# EAGLE board GD32F470 (EAGLE 9.6.2)
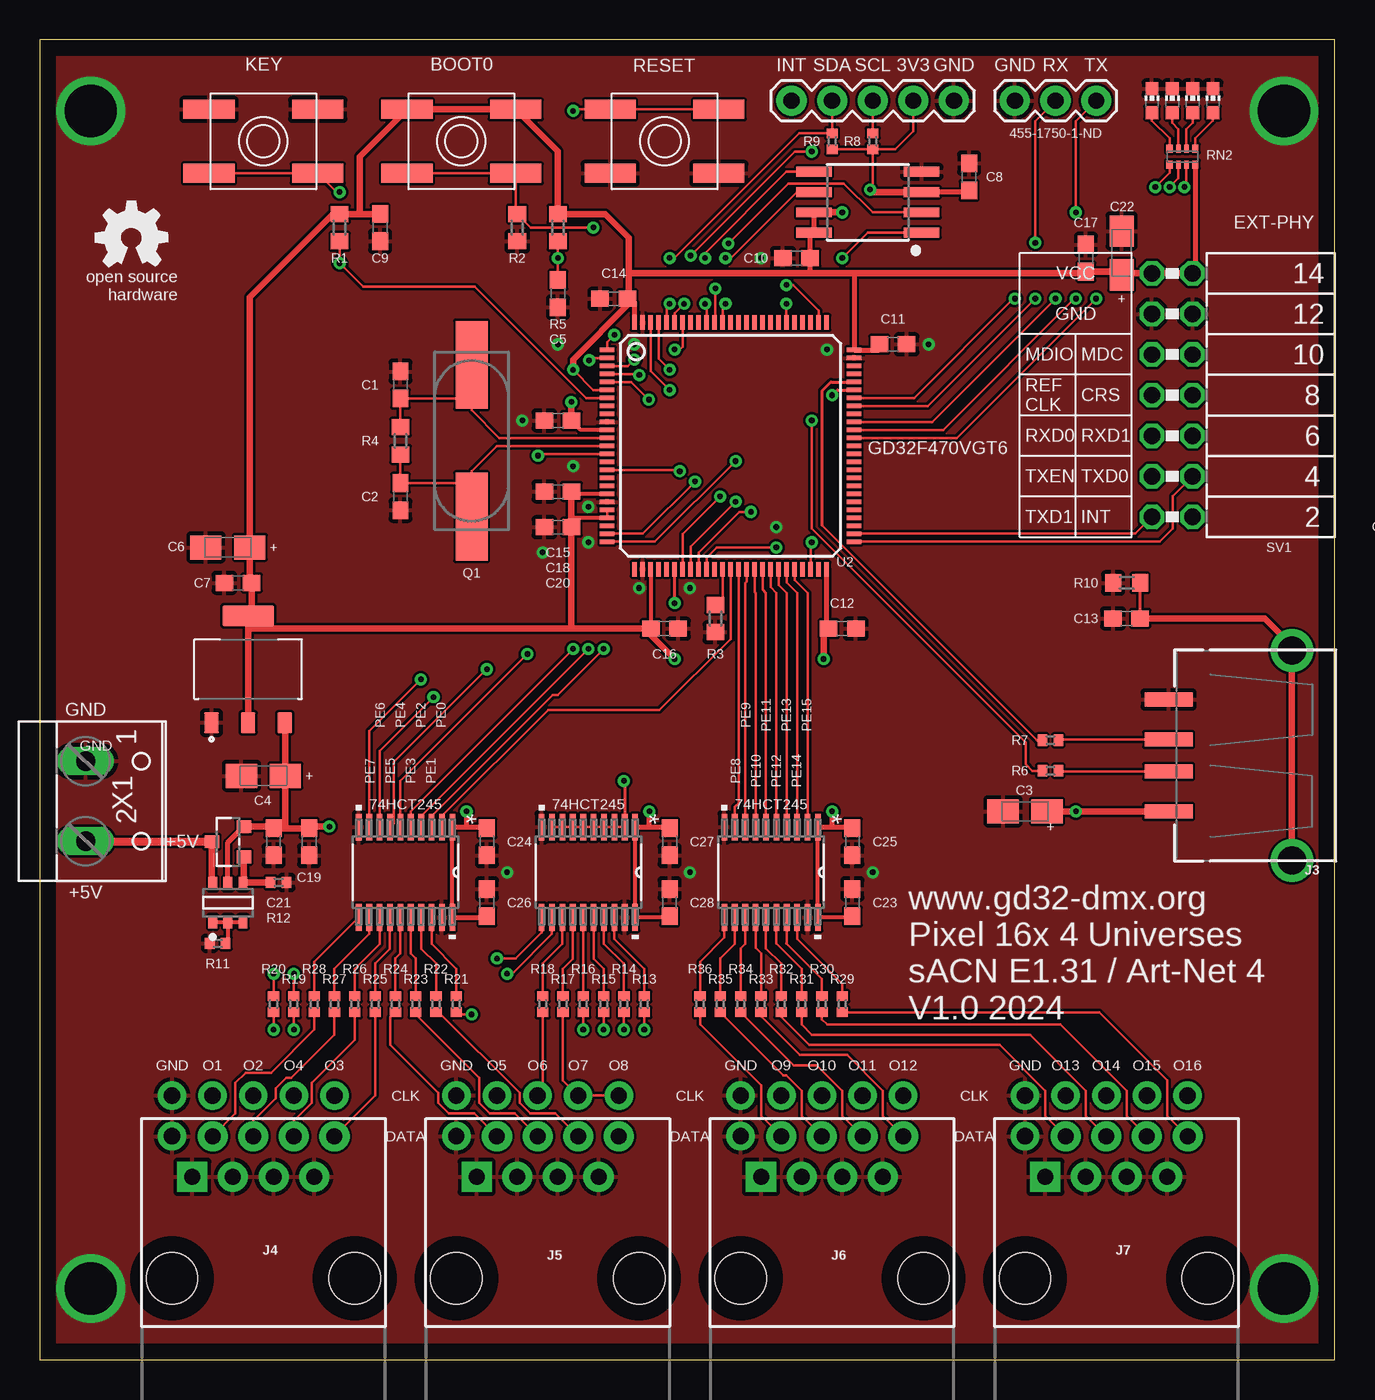
[diagram p1: board, top side]
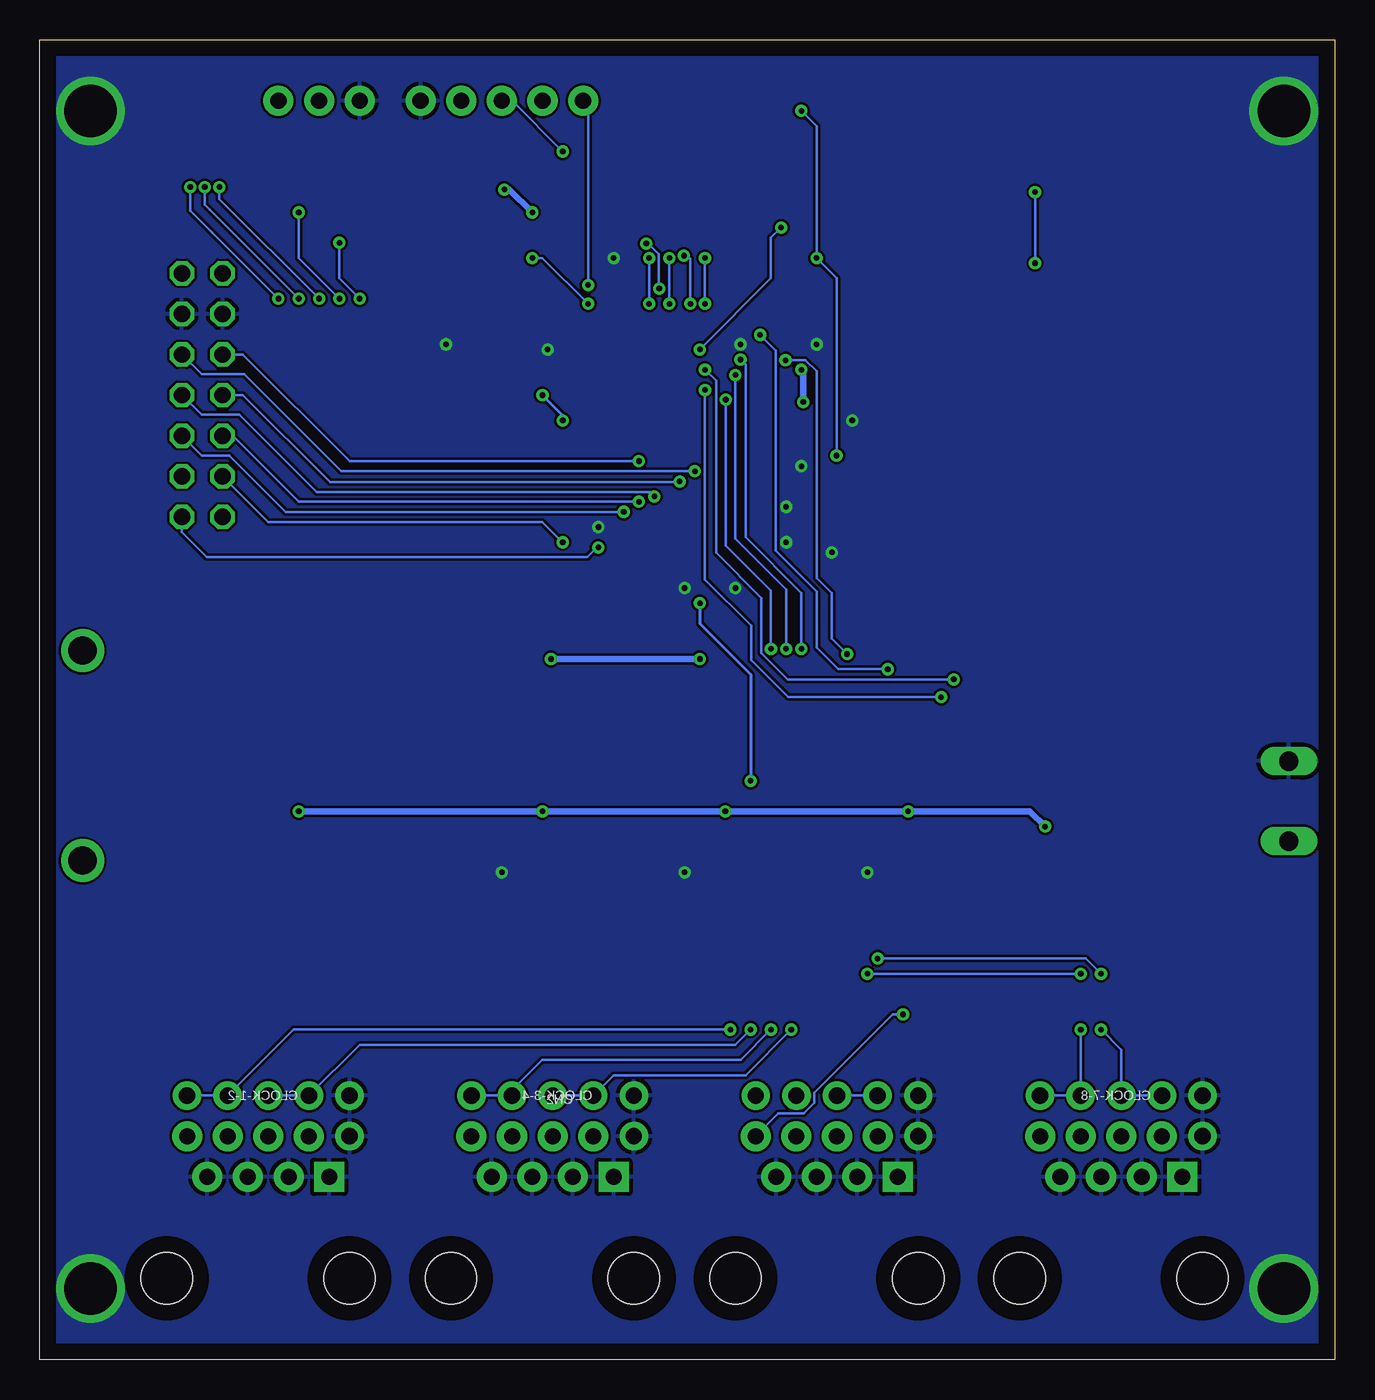
[diagram p2: board, bottom side, seen from below]

Size 80.95 x 82.54 mm. Coordinates in mm from the lower left corner, seen from the top.
Outline: 0,0 80.95,0 80.95,82.54 0,82.54 0,0
Copper layers (1*16): Top 0.035mm / dielectric 1.5mm / Bottom 0.035mm
Design rules "default": minimum track width 6mil, minimum drill 0.35mm, track to track 6mil, track to pad 6mil, pad to pad 6mil, via to via 6mil, smd to smd 6mil, copper to edge 40mil, drill to drill 6mil, minimum pad ring 10mil, minimum via ring 8mil, stop-mask expansion 4mil, vias tented up to drill 0mil, thermal gap 10mil

## Footprints (pad centres in the part's own frame; a part is rotated, then mirrored left to right if it is on the bottom)
C0603 = smd 1.1 x 1: 1 -0.85,0; 2 0.85,0
A/3216-18R = smd 1.95 x 1.5: + 1.375,0; - -1.375,0
1X04-CLEANBIG = drill 1.016 pad 1.778: 1 -3.81,0; 2 -1.27,0; 3 1.27,0; 4 3.81,0
1X03 = drill 1.016 pad 1.88: 1 0,0; 2 2.54,0; 3 5.08,0
1X05 = drill 1.016 pad 1.88: 1 0,0; 2 2.54,0; 3 5.08,0; 4 7.62,0; 5 10.16,0
USB-A = smd 3 x 0.9: D+ 7.212,-1; D- 7.212,1; GND 7.212,-3.5; VBUS 7.212,3.5 | drill 1.778: SHLD1 -0.492,-6.566; SHLD2 -0.492,6.566
RJ45-8 = drill 1 pad 1.88 square: 1 -4.445,6.35 | drill 1 pad 1.88: 2 -3.175,8.89; 3 -1.905,6.35; 4 -0.635,8.89; 5 0.635,6.35; 6 1.905,8.89; 7 3.175,6.35; 8 4.445,8.89 | hole 3.2: -5.715,0; 5.715,0
1X01-CLEANBIG = drill 1.016 pad 1.778: 1 0,0
CHIP-LED0603 = smd 0.8 x 0.8: A 0,-0.75; C 0,0.75
CSM-7X-DU = smd 5.5 x 2: 1 -4.75,0; 2 4.75,0
DIODES_INC._DMG2305UX-13_0 = smd 0.9 x 0.8: 1 -1,0.95; 2 -1,-0.95; 3 1,0
DIODES_DMMT5401-7-F_0 = smd 0.8 x 0.55: 1 -1.2,0.95; 2 -1.2,0; 3 -1.2,-0.95; 4 1.2,-0.95; 5 1.2,0; 6 1.2,0.95
R0603 = smd 1 x 1.1: 1 -0.85,0; 2 0.85,0
R0402 = smd 0.6 x 0.7: 1 -0.5,0; 2 0.5,0
4X0402ARV341 = smd 0.4 x 0.5: 1 -0.8,-0.5; 4 0.8,-0.5; 5 0.8,0.5; 8 -0.8,0.5 | smd 0.3 x 0.5: 2 -0.25,-0.5; 3 0.25,-0.5; 6 0.25,0.5; 7 -0.25,0.5
FE07-2W = drill 1.016 octagon: 1 -7.62,1.27; 2 -7.62,-1.27; 3 -5.08,1.27; 4 -5.08,-1.27; 5 -2.54,1.27; 6 -2.54,-1.27; 7 0,1.27; 8 0,-1.27; 9 2.54,1.27; 10 2.54,-1.27; 11 5.08,1.27; 12 5.08,-1.27; 13 7.62,1.27; 14 7.62,-1.27
EVQ-Q2 = smd 3.2 x 1.2: A -3.4,-2; A' 3.4,-2; B -3.4,2; B' 3.4,2
SOT229P700X180-4N = smd 0.93 x 1.31: 1 -2.29,-3.345; 2 0,-3.345; 3 2.29,-3.345 | smd 3.24 x 1.31: 4 0,3.345
LQFP100 = smd 0.9 x 0.3: 1 -7.72,6; 2 -7.72,5.5; 3 -7.72,5; 4 -7.72,4.5; 5 -7.72,4; 6 -7.72,3.5; 7 -7.72,3; 8 -7.72,2.5; 9 -7.72,2; 10 -7.72,1.5; 11 -7.72,1; 12 -7.72,0.5; 13 -7.72,0; 14 -7.72,-0.5; 15 -7.72,-1; 16 -7.72,-1.5; 17 -7.72,-2; 18 -7.72,-2.5; 19 -7.72,-3; 20 -7.72,-3.5; 21 -7.72,-4; 22 -7.72,-4.5; 23 -7.72,-5; 24 -7.72,-5.5; 25 -7.72,-6; 51 7.72,-6; 52 7.72,-5.5; 53 7.72,-5; 54 7.72,-4.5; 55 7.72,-4; 56 7.72,-3.5; 57 7.72,-3; 58 7.72,-2.5; 59 7.72,-2; 60 7.72,-1.5; 61 7.72,-1; 62 7.72,-0.5; 63 7.72,0; 64 7.72,0.5; 65 7.72,1; 66 7.72,1.5; 67 7.72,2; 68 7.72,2.5; 69 7.72,3; 70 7.72,3.5; 71 7.72,4; 72 7.72,4.5; 73 7.72,5; 74 7.72,5.5; 75 7.72,6 | smd 0.3 x 0.9: 26 -6,-7.72; 27 -5.5,-7.72; 28 -5,-7.72; 29 -4.5,-7.72; 30 -4,-7.72; 31 -3.5,-7.72; 32 -3,-7.72; 33 -2.5,-7.72; 34 -2,-7.72; 35 -1.5,-7.72; 36 -1,-7.72; 37 -0.5,-7.72; 38 0,-7.72; 39 0.5,-7.72; 40 1,-7.72; 41 1.5,-7.72; 42 2,-7.72; 43 2.5,-7.72; 44 3,-7.72; 45 3.5,-7.72; 46 4,-7.72; 47 4.5,-7.72; 48 5,-7.72; 49 5.5,-7.72; 50 6,-7.72; 76 6,7.72; 77 5.5,7.72; 78 5,7.72; 79 4.5,7.72; 80 4,7.72; 81 3.5,7.72; 82 3,7.72; 83 2.5,7.72; 84 2,7.72; 85 1.5,7.72; 86 1,7.72; 87 0.5,7.72; 88 0,7.72; 89 -0.5,7.72; 90 -1,7.72; 91 -1.5,7.72; 92 -2,7.72; 93 -2.5,7.72; 94 -3,7.72; 95 -3.5,7.72; 96 -4,7.72; 97 -4.5,7.72; 98 -5,7.72; 99 -5.5,7.72; 100 -6,7.72
SO08-EIAJ = smd 0.61 x 2.21: 1 -1.905,-3.378; 2 -0.635,-3.378; 3 0.635,-3.378; 4 1.905,-3.378; 5 1.905,3.353; 6 0.635,3.353; 7 -0.635,3.353; 8 -1.905,3.353
PW20 = smd 1.676 x 0.356: 1 -2.819,2.925; 2 -2.819,2.275; 3 -2.819,1.625; 4 -2.819,0.975; 5 -2.819,0.325; 6 -2.819,-0.325; 7 -2.819,-0.975; 8 -2.819,-1.625; 9 -2.819,-2.275; 10 -2.819,-2.925; 11 2.819,-2.925; 12 2.819,-2.275; 13 2.819,-1.625; 14 2.819,-0.975; 15 2.819,-0.325; 16 2.819,0.325; 17 2.819,0.975; 18 2.819,1.625; 19 2.819,2.275; 20 2.819,2.925
W237-102 = drill 1.194 long: 1 -2.5,-1.27; 2 2.5,-1.27

## Placement (x,y rotation side)
C1  20pF  [C0603]  22.54,60.96 270 top
C2  20pF  [C0603]  22.54,53.98 90 top
C3  10uF  [A/3216-18R]  61.59,34.29 0 top
C4  10uF  [A/3216-18R]  13.97,36.51 0 top
C5  100n  [C0603]  32.38,66.67 270 top
C6  10uF  [A/3216-18R]  11.75,50.8 0 top
C7  100n  [C0603]  12.38,48.58 180 top
C8  100n  [C0603]  58.1,73.98 90 top
C9  100n  [C0603]  21.27,70.8 270 top
C10  100n  [C0603]  47.31,68.9 180 top
C11  100n  [C0603]  53.34,63.5 0 top
C12  100n  [C0603]  50.16,45.72 0 top
C13  4700pF/50V  [C0603]  67.94,46.36 180 top
C14  100n  [C0603]  35.88,66.36 180 top
C15  100n  [C0603]  32.38,58.74 180 top
C16  100n  [C0603]  39.05,45.72 0 top
C17  100n  [C0603]  65.41,68.9 90 top
C18  100n  [C0603]  32.38,54.29 180 top
C19  100n  [C0603]  16.83,32.38 270 top
C20  100n  [C0603]  32.38,52.07 180 top
C21  100n  [C0603]  14.61,32.38 270 top
C22  10uF  [A/3216-18R]  67.63,69.21 270 top
C23  100n  [C0603]  50.8,28.57 90 top
C24  100n  [C0603]  27.94,32.38 270 top
C25  100n  [C0603]  50.8,32.38 270 top
C26  100n  [C0603]  27.94,28.57 90 top
C27  100n  [C0603]  39.37,32.38 270 top
C28  100n  [C0603]  39.37,28.57 90 top
CN1  CLOCK-1-2  [1X04-CLEANBIG]  67.94,16.51 180 top
CN2  CLOCK-3-4  [1X04-CLEANBIG]  50.16,16.51 180 top
CN3  CLOCK-5-6  [1X04-CLEANBIG]  32.38,16.51 180 top
CN4  CLOCK-7-8  [1X04-CLEANBIG]  14.61,16.51 180 top
GOLD_ORB_SM1  OSHWLOGOLOGO5MM  [OSHW_5MM]  5.71,70.17 0 top
J1  455-1750-1-ND  [1X03]  60.96,78.74 0 top
J2  I2C+INT  [1X05]  57.15,78.74 180 top
J3  USB_A_SMT_FEMALE  [USB-A]  77.79,37.78 180 top
J4  RJ45  [RJ45-8]  13.97,5.08 0 top
J5  RJ45  [RJ45-8]  31.75,5.08 0 top
J6  RJ45  [RJ45-8]  49.53,5.08 0 top
J7  RJ45  [RJ45-8]  67.31,5.08 0 top
JP1  GND  [1X01-CLEANBIG]  61.59,16.51 0 top
JP2  GND  [1X01-CLEANBIG]  43.81,16.51 0 top
JP3  GND  [1X01-CLEANBIG]  26.04,16.51 0 top
JP4  GND  [1X01-CLEANBIG]  8.26,16.51 0 top
JP5  GND  [1X01-CLEANBIG]  43.81,13.97 0 top
JP6  GND  [1X01-CLEANBIG]  61.59,13.97 0 top
JP7  GND  [1X01-CLEANBIG]  26.04,13.97 0 top
JP8  GND  [1X01-CLEANBIG]  8.26,13.97 0 top
LED5  PWR  [CHIP-LED0603]  73.34,78.74 0 top
LED6  PC7  [CHIP-LED0603]  72.07,78.74 0 top
LED7  PC8  [CHIP-LED0603]  70.8,78.74 0 top
LED8  PC9  [CHIP-LED0603]  69.53,78.74 0 top
Q1  25 MHz  [CSM-7X-DU]  26.99,57.47 90 top
Q2  DMG2305UX  [DIODES_INC._DMG2305UX-13_0]  11.75,32.38 180 top
Q3  DMMT5401  [DIODES_DMMT5401-7-F_0]  11.75,28.57 90 top
R1  10K  [R0603]  18.73,70.8 90 top
R2  10K  [R0603]  29.84,70.8 90 top
R3  10K  [R0603]  42.23,46.36 270 top
R4  1M  [R0603]  22.54,57.47 270 top
R5  10K  [R0603]  32.38,70.8 90 top
R6  22  [R0402]  63.18,36.83 180 top
R7  22  [R0402]  63.18,38.74 180 top
R8  4K7  [R0402]  52.07,76.2 270 top
R9  4K7  [R0402]  49.53,76.2 270 top
R10  1M  [R0603]  67.94,48.58 0 top
R11  10K  [R0402]  11.11,26.04 0 top
R12  47K  [R0402]  14.92,29.84 180 top
R13  100  [R0402]  37.78,22.22 270 top
R14  100  [R0402]  36.51,22.22 270 top
R15  100  [R0402]  35.24,22.22 270 top
R16  100  [R0402]  33.97,22.22 270 top
R17  100  [R0402]  32.7,22.22 270 top
R18  100  [R0402]  31.43,22.22 270 top
R19  100  [R0402]  15.88,22.22 270 top
R20  100  [R0402]  14.61,22.22 270 top
R21  100  [R0402]  26.04,22.22 270 top
R22  100  [R0402]  24.77,22.22 270 top
R23  100  [R0402]  23.5,22.22 270 top
R24  100  [R0402]  22.23,22.22 270 top
R25  100  [R0402]  20.95,22.22 270 top
R26  100  [R0402]  19.68,22.22 270 top
R27  100  [R0402]  18.41,22.22 270 top
R28  100  [R0402]  17.14,22.22 270 top
R29  100  [R0402]  50.16,22.22 270 top
R30  100  [R0402]  48.9,22.22 270 top
R31  100  [R0402]  47.62,22.22 270 top
R32  100  [R0402]  46.35,22.22 270 top
R33  100  [R0402]  45.09,22.22 270 top
R34  100  [R0402]  43.81,22.22 270 top
R35  100  [R0402]  42.55,22.22 270 top
R36  100  [R0402]  41.27,22.22 270 top
RN2  2K  [4X0402ARV341]  71.44,75.25 180 top
SV1  EXT-PHY  [FE07-2W]  70.8,60.33 90 top
SW1  KEY  [EVQ-Q2]  13.97,76.2 180 top
SW2  BOOT0  [EVQ-Q2]  26.35,76.2 180 top
SW3  RESET  [EVQ-Q2]  39.05,76.2 0 top
U1  AMS1117-3.3  [SOT229P700X180-4N]  13.02,43.18 0 top
U2  GD32F470VGT6  [LQFP100]  43.18,57.15 0 top
U3  25F32006WSOI  [SO08-EIAJ]  51.75,72.39 90 top
U4  74HCT245  [PW20]  22.86,30.48 270 top
U5  74HCT245  [PW20]  45.72,30.48 270 top
U6  74HCT245  [PW20]  34.29,30.48 270 top
X1  +5V  [W237-102]  4.13,34.93 270 top

## Tracks (layer width: path | path; a pad name or v marks a point on that pad's centre or on a via)
+3V3  (via drill 0.35)
  Top 0.152: C12.1 49.18,45.86 | U2.21 U2.22 | C11.1 52.49,63.15 | U2.6 34.6,60.65 v33.34,61.91 | J2.2 54.61,76.83 53.48,75.7 R8.2 | R8.2 R9.2 | R8.2 52.07,73.34 v51.91,73.18
  Top 0.254: U2.22 33.29,52.65 33.23,52.71 | U2.19 33.38,54.15 C18.1 | U2.28 38.18,45.74 C16.1 | U2.11 33.82,58.15 C15.1
  Top 0.305: 49.18,45.86 U2.50 | 52.49,63.15 U2.75 50.9,67.84 50.8,67.94 | C8.1 58.08,73.02 U3.3 | U3.7 U3.8 48.16,70.24 C10.1 48.16,68.05 48.26,67.94 | C14.1 36.83,66.46 37.18,66.11 U2.100 | R1.2 18.31,71.65 | 65.3,67.94 C17.1 | RN2.8 72.24,68.43 71.75,67.94
  Top 0.406: C12.1 49,45.4 v49,43.82 | C18.1 33.23,52.71 C20.1 33.23,45.72 C16.1 | C16.1 38.2,45.93 38.1,45.82 38.1,45.4 v39.69,43.82 | v33.23,59.9 33.23,59.89 C15.1 | 13.02,45.72 U1.4 13.23,46.74 C7.1 13.12,48.69 C6.+ 13.12,66.46 18.31,71.65 | 13.02,45.72 U1.2 | C9.1 20,71.65 | 20,71.65 R1.2 | 20,71.65 20,75.25 SW2.A' SW2.A 32.38,75.57 R5.2 35.34,71.65 36.83,70.17 36.83,67.94 | C16.1 13.02,45.72 | U3.7 v50.16,71.75 | U3.3 52.07,73.02 v51.91,73.18 | 36.83,67.94 36.83,66.46 36.83,66.04 33.34,62.55 v33.34,61.91 | 36.83,67.94 48.26,67.94 50.8,67.94 65.3,67.94 | C17.1 67.42,68.05 C22.+ 67.73,67.94 SV1.13 71.75,67.94 SV1.14
  Bottom 0.406: v49,43.82 v39.69,43.82 | v33.23,59.9 33.23,61.8 v33.34,61.91 | v50.16,71.75 51.59,73.18 v51.91,73.18
+5V  (via drill 0.35)
  Top 0.254: U5.1 | U5.1 U5.20 50.74,27.66 C23.1 | C28.1 39.31,27.66 U6.20 U6.1 | U4.1 | U4.20 U4.1 | U6.1
  Top 0.305: Q3.5 11.75,32.34 Q2.2 | U4.20 27.88,27.66 C26.1 | U4.1 26.67,33.3 | 26.67,33.3 27.88,33.3 C24.1 | U6.1 38.1,33.3 | 38.1,33.3 39.31,33.3 C27.1 | U5.1 49.53,33.3 | 49.53,33.3 50.74,33.3 C25.1 | 26.67,33.3 v26.67,34.29 | 38.1,33.3 v38.1,34.29 | 49.53,33.3 v49.53,34.29
  Top 0.406: U1.3 15.35,39.8 C4.+ 15.35,33.34 15.24,33.23 | 15.24,33.23 C19.1 16.93,33.34 v18.1,33.34 | 15.24,33.23 C21.1 14.51,33.34 Q2.2 | C3.+ v64.77,34.29 70.57,34.29 J3.VBUS
  Bottom 0.406: v18.1,33.34 19.05,34.29 v26.67,34.29 v38.1,34.29 v49.53,34.29 v64.77,34.29
BOOT0  (via drill 0.35)
  Top 0.152: SW2.B' SW2.B 29.75,71.74 R2.2 30.7,70.8 v34.61,70.8 | U2.94 40.18,63.36 40.01,63.18 v39.69,63.18
  Bottom 0.152: v39.69,63.18 35.24,67.63 35.24,70.17 v34.61,70.8
BOOT1
  Top 0.152: U2.37 42.68,47.66 R3.1
BOOT_RX  (via drill 0.35)
  Top 0.152: U2.69 54.66,60.15 60.87,66.36 v60.96,66.36 | J1.2 62.23,77.47 v62.23,69.85
  Bottom 0.152: v62.23,69.85 62.23,67.63 v60.96,66.36
BOOT_TX  (via drill 0.35)
  Top 0.152: v62.23,66.36 55.52,59.65 U2.68 | v64.77,71.75 64.77,77.47 J1.3
  Bottom 0.152: v64.77,71.75 64.77,68.9 v62.23,66.36
CLK1  (via drill 0.35)
  Top 0.152: R13.2 v37.78,20.64
  Bottom 0.152: CN1.1 CN1.2 65.09,20.64 v37.78,20.64
CLK2  (via drill 0.35)
  Top 0.152: R14.2 v36.51,20.64
  Bottom 0.152: CN1.3 CN1.4 60.96,19.68 37.47,19.68 v36.51,20.64
CLK3  (via drill 0.35)
  Top 0.152: R15.2 v35.24,20.64
  Bottom 0.152: CN2.1 51.75,16.51 | 51.75,16.51 CN2.2 | 51.75,16.51 49.53,18.73 37.15,18.73 v35.24,20.64
CLK4  (via drill 0.35)
  Top 0.152: R16.2 v33.97,20.64
  Bottom 0.152: CN2.3 CN2.4 45.09,17.78 36.83,17.78 v33.97,20.64
CLK5
  Top 0.152: R17.2 32.7,17.46 CN3.2 CN3.1
CLK6
  Top 0.152: CN3.3 31.43,16.83 R18.2
  Bottom 0.152: CN3.4 CN3.3
CLK7  (via drill 0.35)
  Top 0.152: v15.88,20.64 R19.2
  Bottom 0.152: CN4.1 CN4.2 v15.88,20.64
CLK8  (via drill 0.35)
  Top 0.152: v14.61,20.64 R20.2
  Bottom 0.152: CN4.4 CN4.3 13.34,19.37 v14.61,20.64
ENET_MDC  (via drill 0.35)
  Top 0.152: U2.16 39.92,55.65 v40.01,55.56
  Bottom 0.152: SV1.10 70.84,61.63 68.17,61.63 62.1,55.56 v40.01,55.56
ENET_MDIO  (via drill 0.35)
  Top 0.152: v43.5,56.2 38.45,51.15 U2.25
  Bottom 0.152: SV1.9 68.26,62.87 61.59,56.2 v43.5,56.2
GND  (via drill 0.35, 3.28)
  other vias: 52.07,30.48 29.21,30.48 3.17,78.1 77.79,78.1 55.56,63.5 40.64,30.48 37.15,63.5 49.21,63.18 30.16,58.74 31.43,50.48 40.64,48.26 37.47,48.26 77.79,4.45 3.17,4.45 34.29,51.12 33.34,55.88 34.29,53.34 32.38,63.5 46.04,52.07 45.09,68.9
  pour Top: -1.27,0 82.23,0 82.23,82.55 -1.27,82.55
  pour Bottom: -1.27,82.55 -1.27,0 82.23,0 82.23,82.55
I2C0_SCL  (via drill 0.35)
  Top 0.152: v40.28,66.04 39.68,65.44 U2.95 | J2.3 R8.1 | v40.68,69.05 47.2,75.56 v48.26,75.56
  Bottom 0.152: v40.28,66.04 40.28,68.85 40.48,69.05 v40.68,69.05 | v48.26,75.56 51.44,78.74 J2.3
I2C0_SDA  (via drill 0.35)
  Top 0.152: v39.37,66.04 39.18,65.85 U2.96 | v39.37,68.9 39.4,68.93 39.7,68.93 47.48,76.7 R9.1 J2.4
  Bottom 0.152: v39.37,66.04 v39.37,68.9
KEY  (via drill 0.35)
  Top 0.152: SW1.B' SW1.B | SW1.B 17.56,74.2 17.78,73.98 17.59,73.98 SW1.B | U2.7 34.15,60.15 27.2,67.1 20.95,67.1 20.21,67.1 v18.73,68.58 R1.1 | SW1.B 18.55,73.02 v18.73,73.02
  Bottom 0.152: v18.73,73.02 v18.73,68.58
N$1
  Top 0.152: U4.18 24.48,26 26.04,24.45 R21.1
N$2
  Top 0.254: Q3.1 Q3.2 | Q3.2 Q3.3 | Q3.2 11.75,26.17 R11.2
N$3
  Top 0.152: U4.17 23.84,25.7 24.77,24.77 R22.1
N$4
  Top 0.152: U4.16 23.18,25.39 23.5,25.08 R23.1
N$5
  Top 0.152: U4.15 22.54,25.39 22.23,25.08 R24.1
N$6
  Top 0.152: U4.14 21.89,25.7 20.95,24.77 R25.1
N$7
  Top 0.152: U4.13 21.23,26 19.68,24.45 R26.1
N$8
  Top 0.152: U4.12 20.59,26.62 18.41,24.45 R27.1
N$9
  Top 0.152: U4.11 17.14,24.87 R28.1
N$12
  Top 0.152: U5.18 47.34,26.32 50.16,23.5 R29.1
N$13
  Top 0.152: U5.17 46.7,26.06 46.67,26.04 48.9,23.81 R30.1
N$14
  Top 0.152: U5.16 46.05,26.04 46.04,26.04 47.62,24.45 R31.1
N$15
  Top 0.152: U5.15 45.4,25.72 46.35,24.77 R32.1
N$16
  Top 0.152: U5.14 44.74,25.74 45.09,25.4 R33.1
N$17
  Top 0.152: U5.13 44.09,26 43.81,25.72 R34.1
N$18
  Top 0.152: U5.12 43.45,25.98 42.55,25.08 R35.1
N$19
  Top 0.152: U5.11 42.8,26.39 41.27,24.87 R36.1
N$20
  Top 0.152: J3.D- 63.73,36.78 R6.1
N$21
  Top 0.152: RN2.1 72.24,76.38 73.34,77.49 LED5.A
N$22
  Top 0.152: RN2.2 71.69,76.97 72.07,77.35 LED6.A
N$23
  Top 0.152: RN2.3 71.19,76.97 70.8,77.35 LED7.A
N$24
  Top 0.152: RN2.4 70.64,76.38 69.53,77.49 LED8.A
N$30
  Top 0.406: Q2.1 12.75,29.82 Q3.4 12.77,29.84 R12.2
N$31
  Top 0.406: Q3.6 10.75,29.82 Q2.3 | 2.9,32.38 X1.2
  Top 0.508: Q2.3 2.9,32.38
N$33
  Top 0.152: U6.18 35.91,26.32 37.78,24.45 R13.1
N$34
  Top 0.152: U6.17 35.27,26.01 36.51,24.77 R14.1
N$35
  Top 0.152: U6.16 34.62,25.07 35.24,24.45 R15.1
N$36
  Top 0.152: U6.15 33.97,22.73 R16.1
N$37
  Top 0.152: U6.14 33.31,25.06 32.7,24.45 R17.1
N$38
  Top 0.152: U6.13 32.66,26 31.43,24.77 R18.1
N$39  (via drill 0.35)
  Top 0.152: U6.12 32.02,26.62 29.53,24.13 v29.21,24.13 | v15.88,24.13 R19.1
  Bottom 0.152: v29.21,24.13 v15.88,24.13
N$40  (via drill 0.35)
  Top 0.152: U6.11 31.36,26.71 29.74,25.08 v28.57,25.08 | v14.61,24.13 R20.1
  Bottom 0.152: v28.57,25.08 15.56,25.08 v14.61,24.13
N$47
  Top 0.152: R7.1 63.73,38.78 J3.D+
NRST  (via drill 0.35)
  Top 0.152: SW3.B' SW3.B 33.43,78.2 v33.34,78.1 | U2.14 31.25,56.65 v31.14,56.54 | R5.1 v32.38,68.9 C5.1
  Bottom 0.152: v31.14,56.54 31.14,67.66 v32.38,68.9 32.38,77.15 v33.34,78.1
O1
  Top 0.152: J4.2 12.22,15.39 12.22,17.29 12.87,17.95 14.45,17.95 17.14,20.64 R28.2
O2
  Top 0.152: J4.4 13.34,14.93 14.76,16.35 14.76,16.97 15.41,17.63 15.72,17.63 18.41,20.32 R27.2
O3
  Top 0.152: J4.6 15.88,14.93 16.99,16.05 16.99,17.31 19.68,20 R26.2
O4
  Top 0.152: J4.8 20.95,16.51 R25.2
O5
  Top 0.152: J5.2 27.15,15.39 25.57,15.39 24.92,16.05 24.92,16.68 21.91,19.68 21.91,21.41 R24.2
O6
  Top 0.152: R23.2 23.5,21.59 27.46,17.63 27.46,16.05 28.11,15.39 29.69,15.39 J5.4
O7
  Top 0.152: J5.6 32.23,15.39 30.65,15.39 30,16.05 30,16.67 24.94,21.72 R22.2
O8  (via drill 0.35)
  Top 0.152: v26.99,21.59 26.17,21.59 R21.2
  Bottom 0.152: J5.8 34.77,15.39 33.19,15.39 32.54,16.05 32.54,16.67 27.62,21.59 v26.99,21.59
O9
  Top 0.152: R36.2 41.27,20.95 45.09,17.14 45.09,15.24 J6.2
O10
  Top 0.152: J6.4 47.62,15.24 47.62,16.82 46.67,17.78 46.49,17.78 R35.2
O11
  Top 0.152: J6.6 50.16,15.24 50.16,16.82 48.57,18.41 47.12,18.41 R34.2
O12
  Top 0.152: J6.8 52.7,15.24 52.7,16.82 50.48,19.05 47.51,19.05 45.09,21.48 R33.2
O13
  Top 0.152: J7.2 62.87,15.24 62.87,16.82 60,19.68 48.11,19.68 46.35,21.44 R32.2
O14
  Top 0.152: J7.4 65.41,15.24 65.41,16.82 61.91,20.32 48.26,20.32 47.62,20.95 R31.2
O15
  Top 0.152: J7.6 67.94,15.24 67.94,16.82 63.81,20.95 49.21,20.95 48.9,21.27 R30.2
O16
  Top 0.152: R29.2 66.22,21.72 70.48,17.46 70.48,15.24 J7.8
OSC_IN
  Top 0.152: U2.12 28.71,57.65 26.99,59.37 26.99,60.33 | 26.99,60.33 Q1.2 | 26.99,60.33 26.77,60.11 C1.2 R4.1
OSC_OUT
  Top 0.152: U2.13 28.57,57.15 26.99,55.56 26.99,54.93 | 26.99,54.93 Q1.1 | 26.99,54.93 26.89,54.83 C2.2 R4.2
PA6  (via drill 0.35)
  Top 0.152: U6.2 U6.3 U6.4 U6.5 U6.6 U6.7 U6.8 U6.9 | U2.31
  Top 0.203: U6.2 36.56,36.14 v36.51,36.2 | v39.69,47.31 U2.31
  Bottom 0.203: v36.51,36.2 36.51,42.86 39.69,46.04 v39.69,47.31
PA11  (via drill 0.35)
  Top 0.152: R6.2 62.05,36.83 61.62,37.25 61.62,38.61 48.26,51.98 v48.26,58.74
  Top 0.203: v49.53,60.33 49.85,60.65 U2.70
  Bottom 0.203: v48.26,58.74 48.26,59.05 v49.53,60.33
PA12
  Top 0.152: 48.9,52.19 62.36,38.74
  Top 0.203: U2.71 49.46,61.15 48.9,60.59 48.9,52.19 | 62.36,38.74 R7.2
PA15  (via drill 0.35)
  Top 0.152: v46.67,67.21 47.09,67.21 48.68,65.62 U2.77
  Bottom 0.152: J2.5 46.67,78.42 v46.67,67.21
PC7  (via drill 0.35)
  Top 0.152: U2.64 57.33,57.65 v66.04,66.36 | RN2.7 71.69,73.48 v71.56,73.34
  Bottom 0.152: v66.04,66.36 70.17,70.48 70.27,70.59 71.56,71.87 v71.56,73.34
PC8  (via drill 0.35)
  Top 0.152: v64.77,66.36 64.68,66.36 56.47,58.15 U2.65 | RN2.6 71.19,73.88 v70.65,73.34
  Bottom 0.152: v64.77,66.36 70.33,71.91 70.33,71.92 70.65,72.23 v70.65,73.34
PC9  (via drill 0.35)
  Top 0.152: U2.66 55.79,58.65 v63.5,66.36 | RN2.5 70.64,74.24 v69.74,73.34
  Bottom 0.152: v69.74,73.34 69.74,72.59 v63.5,66.36
PD0  (via drill 0.35)
  Top 0.152: U3.1 51.75,70.48 v50.16,68.9 | v46.67,66.04 U2.81
  Bottom 0.152: v50.16,68.9 49.53,68.9 v46.67,66.04
PE0  (via drill 0.35)
  Top 0.152: U2.97 38.68,62.6 v39.37,61.91 | v23.81,42.55 20.59,39.32 U4.9
  Bottom 0.152: v39.37,61.91 38.68,61.22 38.68,50.46 35.85,47.63 35.85,44.2 34.2,42.55 v23.81,42.55
PE1  (via drill 0.35)
  Top 0.152: U2.98 38.18,61.83 v39.37,60.64 | U4.8 21.23,38.06 v24.61,41.43
  Bottom 0.152: v39.37,60.64 39.37,48.8 36.47,45.9 36.47,43.76 34.15,41.43 v24.61,41.43
PE2  (via drill 0.35)
  Top 0.152: U4.7 22.13,33.54 22.13,37.37 v27.94,43.18 | U2.1 35.46,63.63 v35.92,64.09
  Bottom 0.152: v35.92,64.09 34.94,63.11 34.94,50.59 32.38,48.04 32.38,44.54 31.02,43.18 v27.94,43.18
PE3  (via drill 0.35)
  Top 0.152: v34.33,62.51 34.48,62.65 U2.2 | U4.6 22.54,36.19 v30.48,44.13
  Bottom 0.152: v30.48,44.13 31.43,45.09 31.43,47.94 32.38,48.9 32.38,61.82 33.09,62.52 34.32,62.52 v34.33,62.51
PE4  (via drill 0.35)
  Top 0.152: U4.5 23.18,34.3 v33.34,44.45 | U2.3 36.75,62.15 v37.15,62.55
  Bottom 0.152: v33.34,44.45 33.34,47.94 36.83,51.44 36.83,62.23 v37.15,62.55
PE5  (via drill 0.35)
  Top 0.152: U4.4 23.84,34 v34.29,44.45 | U2.4 37.41,61.65 v37.47,61.59
  Bottom 0.152: v34.29,44.45 34.29,48.17 37.47,51.34 v37.47,61.58 v37.47,61.59
PE6  (via drill 0.35)
  Top 0.152: v35.24,44.45 32.37,41.58 32.08,41.58 24.48,33.99 U4.3 | v38.07,60.04 36.97,61.15 U2.5
  Bottom 0.152: v35.24,44.45 35.24,48.09 38.07,50.92 v38.07,60.04
PE7
  Top 0.152: U2.38 43.18,45.08 38.74,40.64 31.79,40.64 25.14,33.99 U4.2
PE8
  Top 0.152: U2.39 43.68,34.79 43.45,34.55 U5.9
PE9
  Top 0.152: U5.8 44.09,48.58 44.18,48.66 U2.40
PE10
  Top 0.152: U5.7 44.74,47.94 44.68,48.01 U2.41
PE11
  Top 0.152: U5.6 45.4,47.94 45.18,48.16 U2.42
PE12
  Top 0.152: U5.5 46.05,47.94 45.68,48.31 U2.43
PE13
  Top 0.152: U5.4 46.7,47.94 46.18,48.46 U2.44
PE14
  Top 0.152: U5.3 47.34,47.94 46.68,48.61 U2.45
PE15
  Top 0.152: U5.2 47.99,47.94 47.18,48.76 U2.46
PHY_INT  (via drill 0.35)
  Top 0.152: v46.04,50.8 42.31,50.8 41.68,50.17 U2.35
  Bottom 0.152: v46.04,50.8 46.13,50.8 46.74,50.19 70.51,50.19 72.07,51.75 SV1.2
RMII_CRS_DV  (via drill 0.35)
  Top 0.152: U2.32 40.18,51.64 v42.53,53.99
  Bottom 0.152: SV1.8 70.84,59.09 68.49,59.09 63.66,54.26 42.8,54.26 v42.53,53.99
RMII_REF_CLK  (via drill 0.35)
  Top 0.152: U2.24 37.68,51.65 v40.96,54.93
  Bottom 0.152: v40.96,54.93 41.01,54.87 62.81,54.87 68.26,60.33 SV1.7
RMII_RXD0  (via drill 0.35)
  Top 0.152: U2.33 40.68,50.84 v43.5,53.66
  Bottom 0.152: v43.5,53.66 64.77,53.66 68.9,57.79 SV1.5
RMII_RXD1  (via drill 0.35)
  Top 0.152: v44.45,53.02 43.71,53.02 41.18,50.49 U2.34
  Bottom 0.152: SV1.6 70.84,56.55 69.12,56.55 65.59,53.02 v44.45,53.02
RMII_TX_EN  (via drill 0.35)
  Top 0.152: U2.48 48.18,51.04 v48.26,51.12
  Bottom 0.152: v48.26,51.12 49.53,52.39 66.67,52.39 SV1.3
RMII_TXD0
  Top 0.152: SV1.4 70.84,54.01 70.84,51.98 70.01,51.15 U2.51
RMII_TXD1
  Top 0.152: U2.52 68.48,51.65 SV1.1
SHLD
  Top 0.203: 68.9,46.36 C13.1 R10.2
  Top 0.406: 68.9,46.36 76.59,46.36 78.28,44.67 J3.SHLD1 J3.SHLD2
SPI2_MISO  (via drill 0.35)
  Top 0.152: U3.2 52.07,71.75 50.27,73.56 46.79,73.56 v43.04,69.81 | v42.23,67 42.23,64.92 U2.90
  Bottom 0.152: v43.04,69.81 42.91,69.81 42.26,69.15 42.26,67.02 v42.23,67
SPI2_MOSI  (via drill 0.35)
  Top 0.152: U3.5 46.67,74.3 41.59,69.21 v41.59,68.9 | v41.59,66.04 41.68,65.95 U2.91
  Bottom 0.152: v41.59,68.9 v41.59,66.04
SPI2_SCK  (via drill 0.35)
  Top 0.152: U3.6 47.31,73.02 43.18,68.9 v42.86,68.9 | v42.86,66.04 42.68,65.86 U2.89
  Bottom 0.152: v42.86,68.9 v42.86,66.04

## Text on the board
tPlace: www.gd32-dmx.org / Pixel 16x 4 Universes / sACN E1.31 / Art-Net 4 / V1.0 2024
tNames: INT | SDA | SCL | 3V3 | GND | GND | RX | TX | VCC | + | GND | MDIO | MDC | REF / CLK | CRS | RXD0 | RXD1 | TXEN | TXD0 | TXD1 | INT | + | GND | PE6 | PE4 | PE2 | PE0 | PE9 | PE11 | PE13 | PE15 | GND | PE7 | PE5 | PE3 | PE1 | PE8 | PE10 | PE12 | PE14 | + | + | +5V | +5V | GND | O1 | O2 | O4 | O3 | GND | O5 | O6 | O7 | O8 | GND | O9 | O10 | O11 | O12 | GND | O13 | O14 | O15 | O16 | CLK | CLK | CLK | DATA | DATA | DATA